# Altium schematic sheet Microcontroller.SchDoc
size A1; SheetNumber: 3; SheetTotal: 5
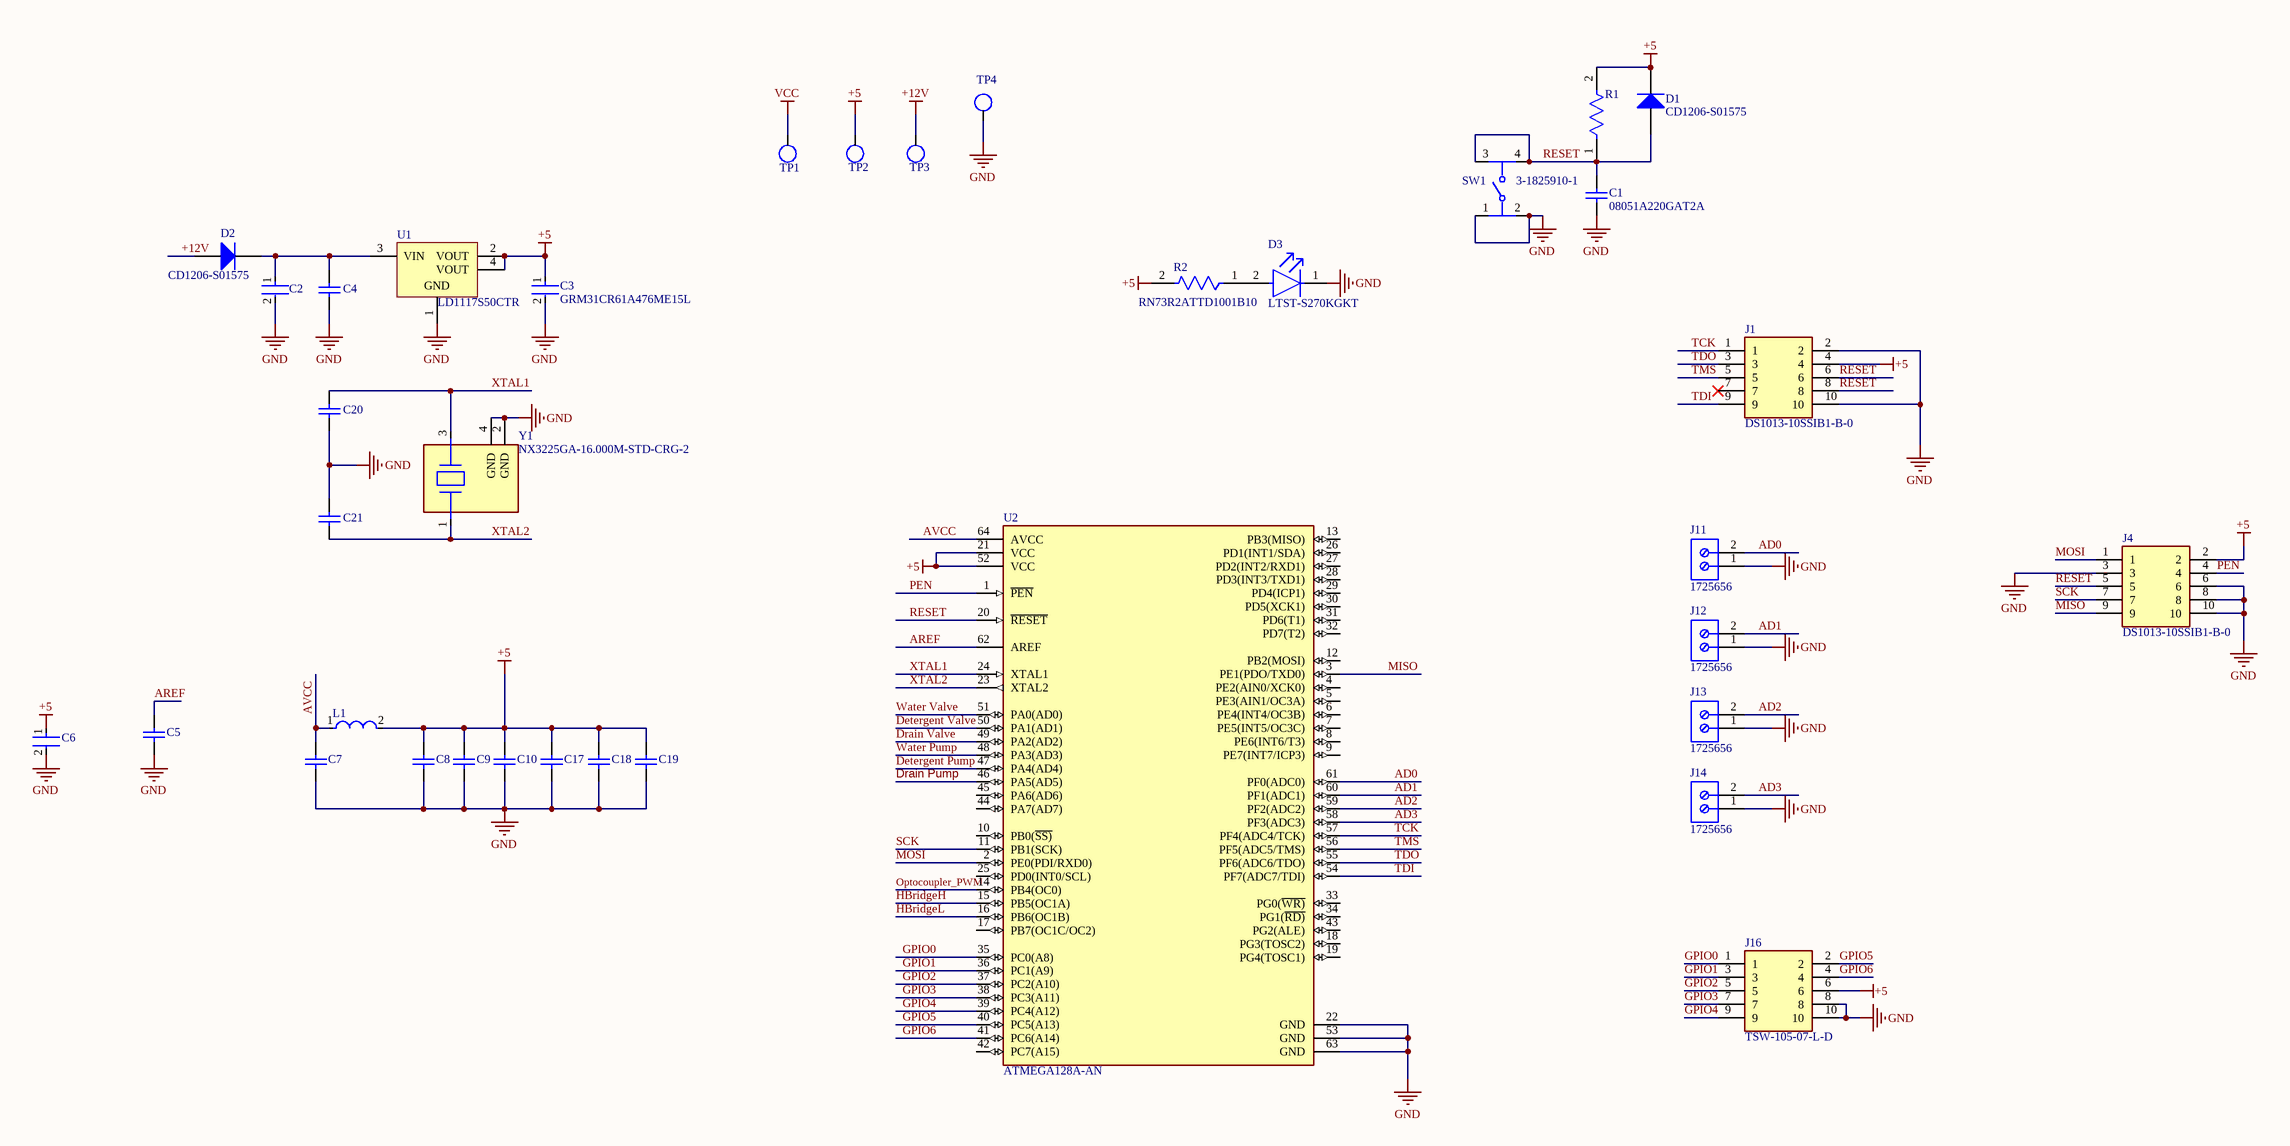
[diagram p0: Microcontroller.SchDoc]

## Parts
C1  08051A220GAT2A  [CAPC2013X94X50ML20T25]
C2  GRM31CR61A476ME15L  [FP-GRM31C-0_2-e0_3_0_8-IPC_B]  (value not drawn)
C3  GRM31CR61A476ME15L  [FP-GRM31C-0_2-e0_3_0_8-IPC_B]
C4  VJ0805Y104KFAAT  [CAPC2013X145X48NL20T23]  (value not drawn)
C5  CAP 100nF 100V 1206(3216)  [CAPC1206(3216)170_M]  (value not drawn)
C6  C1206C107M9PACTU  [FP-C1206C-EH-MFG]  (value not drawn)
C7  CAP 100nF 100V 1206(3216)  [CAPC1206(3216)170_M]  (value not drawn)
C8  CAP 100nF 100V 1206(3216)  [CAPC1206(3216)170_M]  (value not drawn)
C9  CAP 100nF 100V 1206(3216)  [CAPC1206(3216)170_M]  (value not drawn)
C10  CAP 100nF 100V 1206(3216)  [CAPC1206(3216)170_M]  (value not drawn)
C17  CAP 100nF 100V 1206(3216)  [CAPC1206(3216)170_M]  (value not drawn)
C18  CAP 100nF 100V 1206(3216)  [CAPC1206(3216)170_M]  (value not drawn)
C19  CAP 100nF 100V 1206(3216)  [CAPC1206(3216)170_M]  (value not drawn)
C20  VJ0805Y104KFAAT  [CAPC2013X145X48NL20T23]  (value not drawn)
C21  VJ0805Y104KFAAT  [CAPC2013X145X48NL20T23]  (value not drawn)
D1  CD1206-S01575  [BOUR-CD1206-S01575-2_L]
D2  CD1206-S01575  [BOUR-CD1206-S01575-2_L]
D3  LTST-S270KGKT  [FP-LTST-S270KGKT-MFG]
J1  DS1013-10SSIB1-B-0  [DS101310SSIB1B0]
J4  DS1013-10SSIB1-B-0  [DS101310SSIB1B0]
J11  1725656  [PHOE-1725656-2]
J12  1725656  [PHOE-1725656-2]
J13  1725656  [PHOE-1725656-2]
J14  1725656  [PHOE-1725656-2]
J16  TSW-105-07-L-D  [TSW-105-XX-YY-D]
L1  MLZ2012N100LTD25  [FP-MLZ2012-1_25-MFG]  (value not drawn)
R1  RN73C2A10KLTDF  [FP-RN732A-MFG]  (value not drawn)
R2  RN73R2ATTD1001B10  [FP-RN73R2A-IPC_A]
SW1  3-1825910-1  [FP-3-1825910-1-MFG]
TP1  testpoint  [testpoint]  (value not drawn)  (no BOM)
TP2  testpoint  [testpoint]  (value not drawn)  (no BOM)
TP3  testpoint  [testpoint]  (value not drawn)  (no BOM)
TP4  testpoint  [testpoint]  (value not drawn)  (no BOM)
U1  LD1117S50CTR  [SOT-223_N]
U2  ATMEGA128A-AN  [FP-64A-MFG]
Y1  NX3225GA-16.000M-STD-CRG-2  [FP-NX3225GA-MFG]

## Nets
+5: C3.1 C6.1 C8.2 C9.2 C10.2 C17.2 C18.2 C19.2 D1.2(K) J1.4 J4.2 J16.6 L1.2 R1.2 R2.2 TP2.1 U1.2(VOUT) U1.4(VOUT) U2.21(VCC) U2.52(VCC)
+12V: D2.1(A) TP3.1
GND: C1.1 C2.2 C3.2 C4.1 C5.1 C6.2 C7.1 C8.1 C9.1 C10.1 C17.1 C18.1 C19.1 C20.1 C21.2 D3.1(C) J1.2 J1.10 J4.3 J4.6 J4.8 J4.10 J11.1 J12.1 J13.1 J14.1 J16.8 J16.10 SW1.1 SW1.2 TP4.1 U1.1(GND) U2.22(GND) U2.53(GND) U2.63(GND) Y1.2(GND) Y1.4(GND)
VCC: TP1.1
AD0: J11.2 U2.61(PF0(ADC0))
AD1: J12.2 U2.60(PF1(ADC1))
AD2: J13.2 U2.59(PF2(ADC2))
AD3: J14.2 U2.58(PF3(ADC3))
AREF: C5.2 U2.62(AREF)
AVCC: C7.2 L1.1 U2.64(AVCC)
Detergent Pump: U2.47(PA4(AD4))
Detergent Valve: U2.50(PA1(AD1))
Drain Pump: U2.46(PA5(AD5))
Drain Valve: U2.49(PA2(AD2))
GPIO0: J16.1 U2.35(PC0(A8))
GPIO1: J16.3 U2.36(PC1(A9))
GPIO2: J16.5 U2.37(PC2(A10))
GPIO3: J16.7 U2.38(PC3(A11))
GPIO4: J16.9 U2.39(PC4(A12))
GPIO5: J16.2 U2.40(PC5(A13))
GPIO6: J16.4 U2.41(PC6(A14))
HBridgeH: U2.15(PB5(OC1A))
HBridgeL: U2.16(PB6(OC1B))
MISO: J4.9 U2.3(PE1(PDO/TXD0))
MOSI: J4.1 U2.2(PE0(PDI/RXD0))
Optocoupler_PWM: U2.14(PB4(OC0))
PEN: J4.4 U2.1(~{PEN})
RESET: C1.2 D1.1(A) J1.6 J1.8 J4.5 R1.1 SW1.3 SW1.4 U2.20(~{RESET})
SCK: J4.7 U2.11(PB1(SCK))
TCK: J1.1 U2.57(PF4(ADC4/TCK))
TDI: J1.9 U2.54(PF7(ADC7/TDI))
TDO: J1.3 U2.55(PF6(ADC6/TDO))
TMS: J1.5 U2.56(PF5(ADC5/TMS))
Water Pump: U2.48(PA3(AD3))
Water Valve: U2.51(PA0(AD0))
XTAL1: C20.2 U2.24(XTAL1) Y1.3
XTAL2: C21.1 U2.23(XTAL2) Y1.1
NetC2_1: C2.1 C4.2 D2.2(K) U1.3(VIN)
NetD3_2: D3.2(A) R2.1

Not connected (* = marked no-connect by the designer): J1 7*; U2 4(PE2(AIN0/XCK0)) 5(PE3(AIN1/OC3A)) 6(PE4(INT4/OC3B)) 7(PE5(INT5/OC3C)) 8(PE6(INT6/T3)) 9(PE7(INT7/ICP3)) 10(PB0(~{SS)}) 12(PB2(MOSI)) 13(PB3(MISO)) 17(PB7(OC1C/OC2)) 18(PG3(TOSC2)) 19(PG4(TOSC1)) 25(PD0(INT0/SCL)) 26(PD1(INT1/SDA)) 27(PD2(INT2/RXD1)) 28(PD3(INT3/TXD1)) 29(PD4(ICP1)) 30(PD5(XCK1)) 31(PD6(T1)) 32(PD7(T2)) 33(PG0(~{WR)}) 34(PG1(~{RD)}) 42(PC7(A15)) 43(PG2(ALE)) 44(PA7(AD7)) 45(PA6(AD6))

## Library data of the parts
C1 = CMP-1036-01254-2: Manufacturer: AVX Interconnect / Elco; Part Number: 08051A220GAT2A
C2 C3 = CMP-2000-05255-3: Chip Multilayer Ceramic Capacitors for General Purpose, 1206, 47uF, X5R, 15%, 20%, 10V; Case/Package: 1206; Radiation Hardening: No; Case Code (Metric): 3216; Max Operating Temperature: 85°C; Capacitance: 47uF; Tolerance: 20%; REACH SVHC: No SVHC; Depth: 1.6mm; Case Code (Imperial): 1206; Termination: SMD/SMT; Voltage Rating (DC): 10V; Package Quantity: 2000; Voltage Rating: 10V; Width: 1.6mm; Lead Free: Lead Free; Voltage: 10V; Packaging: Tape and Reel; Length: 3.2mm; Height: 1.6mm; Number of Pins: 2; Thickness: 0.071inch; Min Operating Temperature: -55°C; Dielectric: X5R; Mount: Surface Mount
C4 C20 C21 = CMP-2007-01868-1: Manufacturer: Vitramon; Part Number: VJ0805Y104KFAAT
C5 C7-C10 C17-C19 = CMP-1037-04207-2: CAP 100nF 100V ±5% 1206 (3216 Metric) Thickness 1.7mm SMD; Case-Metric: 3216; Case-EIA: 1206; Tolerance: Â±5%; Rated Voltage: 100 V; Technology: SMT; Value: 100nF; Max Thickness: 1.7 mm
C6 = CMP-1037-05005-3: CAP CER 100UF 6.3V X5R 1206; Dielectric Material: Ceramic; Tolerance: 2%; Dissipation Factor: 5%; Min Operating Temperature: -55°C; Case Code (Imperial): 1206; Case Code (Metric): 3216; Depth: 1.6mm; Dielectric: X5R; Max Operating Temperature: 85°C; Packaging: Tape and Reel; Construction: Flat; Series: C; Case/Package: 1206; Radiation Hardening: No; Voltage Rating (DC): 6.3V; Termination: SMD/SMT; Voltage Rating: 6.3V; Capacitance: 100uF; Number of Pins: 2; RoHS Compliant: Yes; Height: 1.6mm; Lead Free: Lead Free; Voltage: 6.3V; REACH SVHC: No SVHC; Length: 3.2mm; Mount: Surface Mount; Package Quantity: 1; Thickness: 0.071inch; Width: 0.063inch
D1 D2 = CMP-0583-00001-2: 75 V Small Signal Switching Diode, 150 mA, 2.5 uA, 1026 Molded Package, RoHS, Tape and Reel; Manufacturer: Bourns; Reverse Voltage: 75 V; Average Forward Current: 150 mA; Reverse Current (Max.): 2.5 uA; Capacitance Between Terminals (Max.): 3 pF; Reverse Recovery Time (Max.): 4 nS; Forward Voltage (Max.): 1.00 V; Packing: Tape and Reel; Mounting Technology: Surface Mount; DatasheetVersion: Rev. 06/11; ComponentLink2URL: http://www.bourns.com/data/global/pdfs/CD1206_S01575.pdf; PackageReference: CD1206-S01575-2; RoHS: TRUE; ComponentLink1URL: http://www.bourns.com/; ComponentLink1Description: Manufacturer URL; ComponentLink3Description: Package Specification; ComponentLink3URL: http://www.bourns.com/data/global/pdfs/CD1206_S01575.pdf; ComponentLink2Description: Datasheet; PackageDescription: 2-Pin SMD, Body 3.2 x 1.5 mm; PartNumber: CD1206-S01575
D3 = CMP-2000-06629-2: LED GREEN CLEAR CHIP SMD R/A; Luminous Intensity: 71mcd; Test Current: 20mA; Dominant Wavelength: 571nm; Lens Style: Diffused; Forward Voltage: 2V; Reverse Voltage: 5V; Wavelength: 574nm; Power Rating: 75mW; Viewing Angle: 130°; Number of Elements: 1; Forward Current: 30mA; Lens Color: Colorless; Package Quantity: 1; Lead Free: Lead Free; Case Code (Imperial): 0603; Lens Transparency: Clear; Width: 1.15mm; Case Code (Metric): 1608; Packaging: Tape and Reel; Depth: 0.6mm; Radiation Hardening: No; Color: Green; Max Operating Temperature: 85°C; Case/Package: 0603; Min Operating Temperature: -55°C; Number of LEDs: 1; Power Dissipation: 75mW; Illumination Color: Green; Number of Pins: 2; Height: 0.6mm; Mount: Surface Mount; Length: 1.6mm
J1 J4 = DS1013-10SSIB1-B-0: Connector; Manufacturer_Name: Connfly; Datasheet Link: https://www.tme.eu/Document/c6e6da985bd9c519d97c4924b5c8a047/DS1013.pdf; Height: 9.48mm; Manufacturer_Part_Number: DS1013-10SSIB1-B-0
J11-J14 = CMP-2000-05299-1: Male Header, Pitch 2.54 mm, 1 x 2 Position, Height 9 mm, Tail Length 3.5 mm; Manufacturer: Phoenix Contact; Number of contacts: 2; Content: 250pc(s); Pitch: 2.54mm; Industrial packaging: Yes; Colour: Green; Manufacturer part No.: 1725656; Type: MPT0,5/2-2,54; Datasheet URL: http://datasheet.octopart.com/1725656-Phoenix-Contact-datasheet-5302866.pdf; Manufacturer URL: http://www.phoenixcontact.com/; Datasheet Version: Apr-08
J16 = TSW-105-07-L-D: Connector; Manufacturer_Name: SAMTEC; Datasheet Link: http://suddendocs.samtec.com/prints/tsw-xxx-xx-xxx-x-xx-xxx-mkt.pdf; Manufacturer_Part_Number: TSW-105-07-L-D; Mouser Part Number: 200-TSW10507LD; Mouser Price/Stock: https://www.mouser.co.uk/ProductDetail/Samtec/TSW-105-07-L-D?qs=iT52DjcXudvrrMSG1pzmcQ%3D%3D; Arrow Part Number: TSW-105-07-L-D; Arrow Price/Stock: https://www.arrow.com/en/products/tsw-105-07-l-d/samtec?region=europe
L1 = CMP-08253-000042-1: Shielded Multilayer Inductor 10uH ±20% 500mA 390mΩ AEC-Q200 SMD 0805; Test Frequency: 2MHz; Saturation Current: 110mA; DC Resistance (DCR): 390mR; Core Material: Ferrite; Resistance: 0.39R; Width: 0.049inch; RoHS Compliant: Yes; Current Rating: 500mA; Weight: 0.000194oz; Inductance: 10uH; Packaging: Tape and Reel; Height: 1.25mm; Mount: Surface Mount; Max DC Current: 500mA; Lead Free: Lead Free; Case Code (Metric): 2012; Length: 0.079inch; Case Code (Imperial): 0805; Min Operating Temperature: -55°C; Package Quantity: 2000; Termination: SMD/SMT; Case/Package: 0805; Shielding: Shielded; Ratings: AEC-Q200; Max Operating Temperature: 125°C; Height - Seated (Max): 0.057inch; Tolerance: 20%
R1 = CMP-03211-000999-1: SMD Chip Resistor, Thin Film, 10.LKΩ, 100 V, 0805 [2012 Metric], 100 mW, 0.1%, RN73 Series; Manufacturer: TE Connectivity; Power Rating: 0.1W; Temperature Coefficient: 10ppm/°C; Tolerance: 42; Voltage Rating: 100V; Composition: Thin Film; Resistance: 10.LKΩ; Temperature Range Low: -55°C; Category: Res; Device Class L1: Passive Components; ComponentLink2Description: Datasheet; Lead Free: Yes; Temperature Range High: 155°C; packaging: 1000 Reel; Series: RN73; ComponentLink2URL: https://www.te.com/commerce/DocumentDelivery/DDEController?Action=showdoc&DocId=Data+Sheet%7F1773270%7FP%7Fpdf%7FEnglish%7FENG_DS_1773270_P.pdf%7F1676162-2; Package: RN732A; Device Class L2: Resistors; Automotive: No; Octopart: https://octopart.com/rn73c2a10kltdf-te+connectivity-22738657; RoHS: TRUE; Temperature: -55°C to 155°C; octopart_url: https://octopart.com/rn73c2a10kltdf-te+connectivity-22738657; Value: 10.LKΩ; Device Class L3: Chip SMD Resistors; Height: 0.65mm; Manufacturer Part Number: RN73C2A10KLTDF; Ipc Land Pattern Name: RESC200125X55
R2 = CMP-04015-026717-1: 1kΩ ±0.1% 0.125W, 1/8W Chip Resistor 0805 (2012 Metric) Moisture Resistant Thin Film
SW1 = CMP-03407-000001-1: SWITCH TACTILE SPST-NO 0.05A 24V; Manufacturer: TE Connectivity; Operating Force: 160gf; Contact Current Rating: 50mA; Contact Resistance: 100mΩ; Electromechanical Life: 100000Cycles; Device Class L1: Electromechanical; ComponentLink2URL: https://www.te.com/commerce/DocumentDelivery/DDEController?Action=srchrtrv&DocNm=1825910&DocType=Customer+Drawing&DocLang=English; Category: Switch; Device Class L2: Switches; Temperature: -35°C to +85°C; RoHS: TRUE; Mount: Through Hole; Manufacturer Part Number: 3-1825910-1; Automotive: No; Lead Free: Yes; Device Class L3: Tactile Switches; ComponentLink2Description: Datasheet; Temperature Range High: +85°C; Height: 17.3mm; Package: 0; Temperature Range Low: -35°C; Throw Configuration: SPST-NO; Digikey Description: SWITCH TACTILE SPST-NO 0.05A 24V; Octopart: https://octopart.com/3-1825910-1-te+connectivity-46506874
U1 = CMP-0244-00311-1: Fixed Low Drop Positive Voltage Regulator, 5V, 4-Pin SOT-223, Tape and Reel; PackageReference: SOT-223; PackageVersion: 2010; ComponentLink2URL: http://www.st.com/internet/com/TECHNICAL_RESOURCES/TECHNICAL_LITERATURE/DATASHEET/CD00000544.pdf; ComponentLink1URL: http://www.st.com; ComponentLink2Description: Datasheet; DatasheetVersion: 1/11/2011; ComponentLink1Description: Manufacturer URL; PackageDescription: 4-Pin SOT-223 Package, 6.5 x 3.5 mm Body, 2.3 mm Pitch, 7 mm Lead Span
U2 = CMP-00252-77759823-2: ATMEGA128A-AN 64KB 2.7V~5.5V AVR 16MHz FLASH 53 LQFP-64(14x14) Microcontroller Units (MCUs/MPUs/SOCs) ROHS; Manufacturer Package Identifier: 64A; Number of I2C Channels: 1; Min Supply Voltage: 2.7V; Oscillator Type: Internal; Memory Size: 128kB; Number of Timers/Counters: 4; Number of ADC Channels: 6; Max Supply Voltage: 5.5V; Data Bus Width: 8b; RAM Size: 4kB; Number of I/Os: 53; Interface: I2C, SPI, UART, USART; Peripherals: Brown-out Detect/Reset, POR, PWM, WDT; Memory Type: FLASH; RoHS: Compliant; Number of Pins: 64; Case/Package: TQFP; Mount: Surface Mount; Schedule B: 8542310000, 8542310000; Number of SPI Channels: 1; Height: 1.2mm; Number of A/D Converters: 1; Min Operating Temperature: -40°C; Core Architecture: AVR; Max Operating Temperature: 85°C; Lead Free: Lead Free; Number of PWM Channels: 6; Lifecycle Status: Production; Frequency: 16MHz; NexarPartId: 77759823
Y1 = CMP-200220-000007-1: CRYSTAL 16.0000MHZ 8PF SMD; Frequency Stability: 30ppm; Frequency Tolerance: 20ppm; Frequency: 16MHz; ESR (Equivalent Series Resistance): 80R; Min Operating Temperature: -40°C; Mount: Surface Mount; Width: 0.098inch; Case/Package: SMD/SMT; Max Operating Temperature: 85°C; Number of Pins: 4; Length: 0.126inch; Load Capacitance: 8pF; Packaging: Tape and Reel; Package Quantity: 3000; Height: 0.035inch